# EAGLE schematic board1 (EAGLE 5.12)
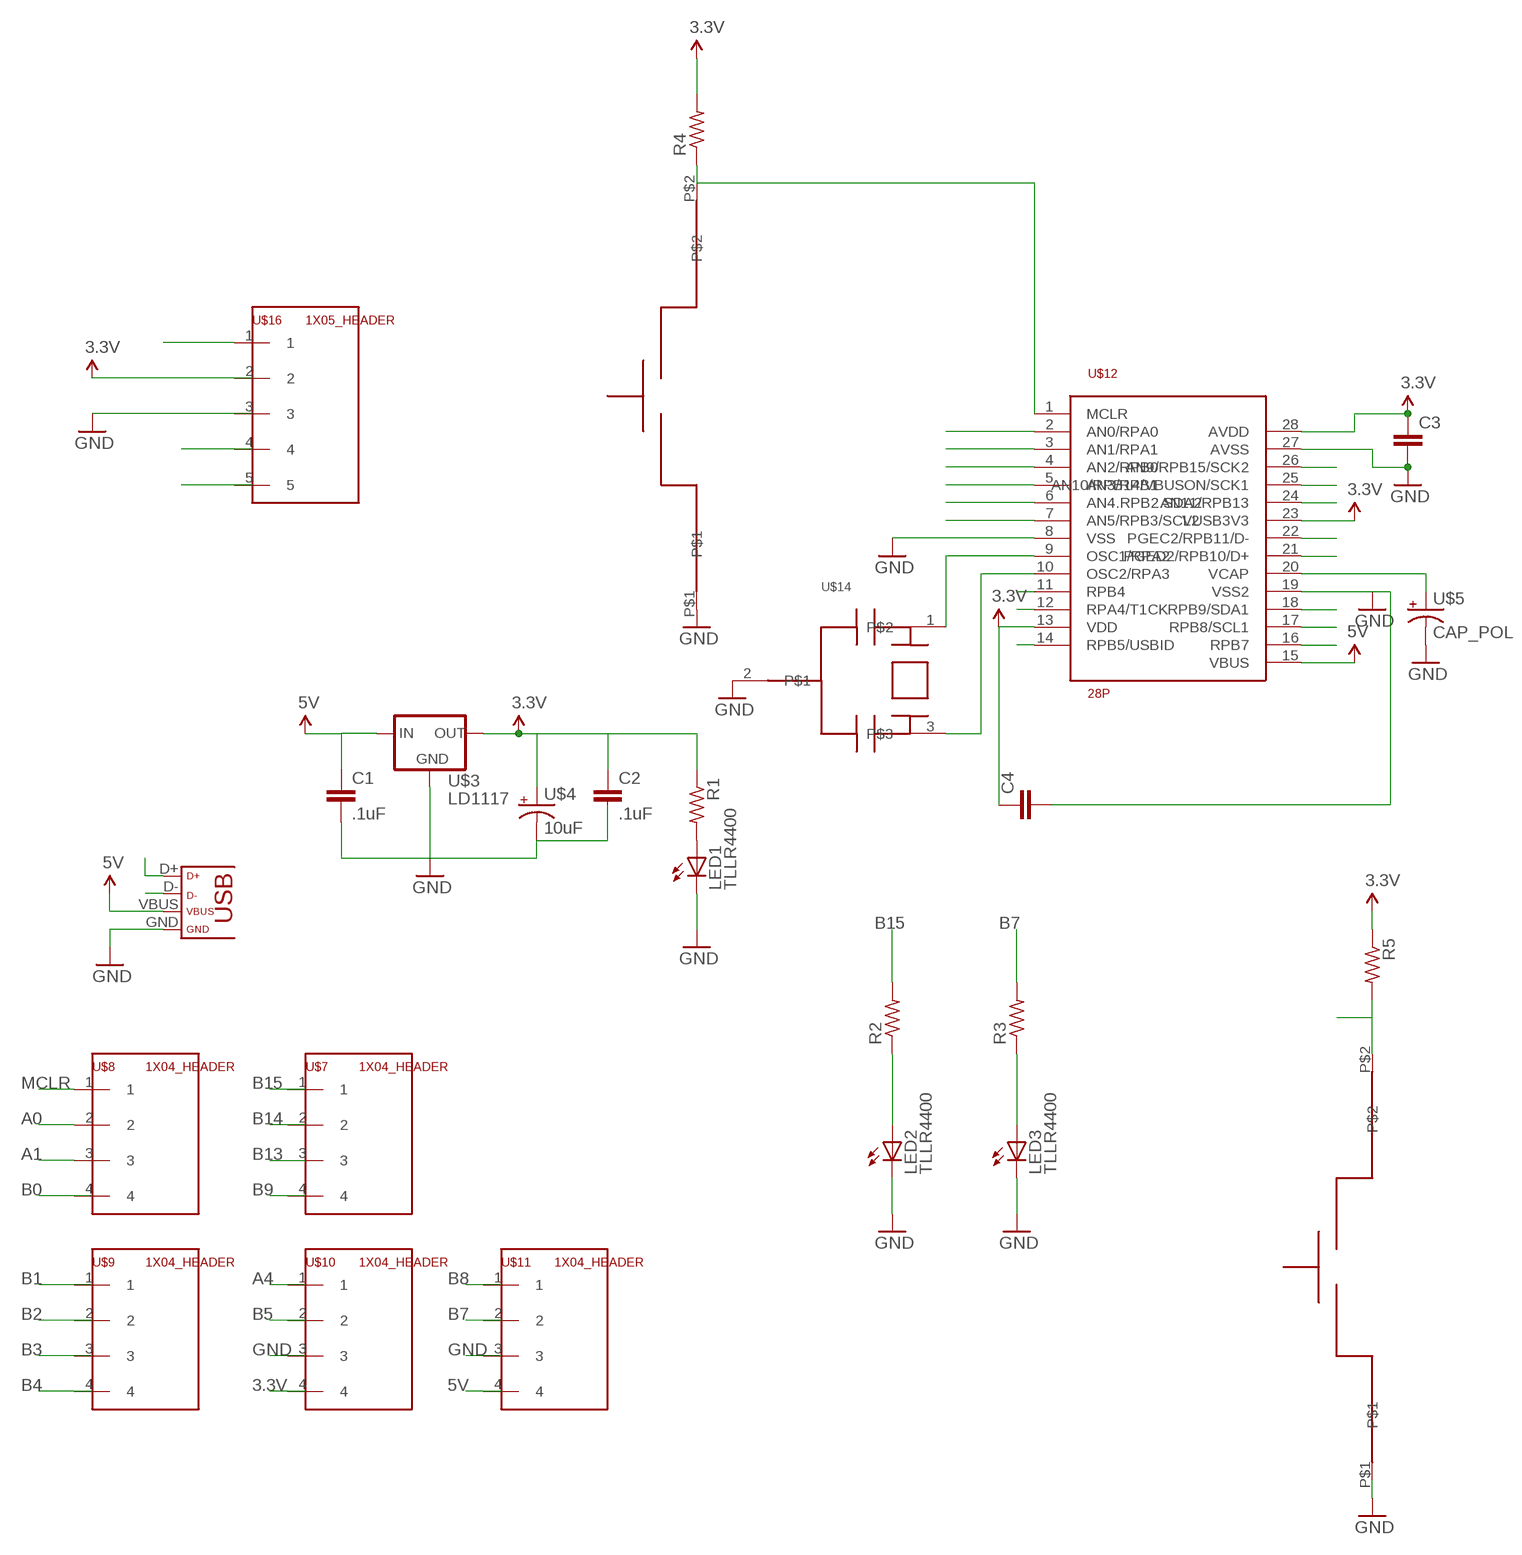
[diagram p0: schematic, sheet 1]

## Parts
C1  .1uF  C2.5/2  [C2.5-2]
C2  .1uF  C2.5/2  [C2.5-2]
C3  C2.5/2  [C2.5-2]
C4  C2.5/2  [C2.5-2]
LED1  TLLR4400  [LED3MM]
LED2  TLLR4400  [LED3MM]
LED3  TLLR4400  [LED3MM]
R1  R-US_M3216  [M3216]
R2  R-US_M3216  [M3216]
R3  R-US_M3216  [M3216]
R4  R-US_M3216  [M3216]
R5  R-US_M3216  [M3216]
U$1  USB  [USB-MINIB]
U$3  LD1117  [TO220]
U$4  10uF  CAP_POL  [CAP_POL_D]
U$5  CAP_POL  [CAP_POL_D]
U$7  1X04_HEADER  [1X04]
U$8  1X04_HEADER  [1X04]
U$9  1X04_HEADER  [1X04]
U$10  1X04_HEADER  [1X04]
U$11  1X04_HEADER  [1X04]
U$12  28P  [DIL28-3]
U$13  SWITCH  [SWITCH]
U$14  8MHZ_RESONATOR  [HC49U]
U$16  1X05_HEADER  [1X05]
U$17  SWITCH  [SWITCH]

## Nets
3.3V: C2.1 C3.1 C4.1 R1.1 R4.2 R5.1 U$3.2(OUT) U$4.1(+) U$12.13(VDD) U$12.23(VUSB3V3) U$12.28(AVDD)
5V: C1.1 U$1.VBUS U$3.3(IN) U$12.15(VBUS)
A0: U$8.2 U$12.2(AN0/RPA0)
A1: U$8.3 U$12.3(AN1/RPA1)
A4: U$12.12(RPA4/T1CK)
B0: U$12.4(AN2/RPB0)
B1: U$12.5(AN3/RPB1)
B2: U$12.6(AN4.RPB2.SDA2)
B3: U$12.7(AN5/RPB3/SCL2)
B4: U$12.11(RPB4)
B5: U$12.14(RPB5/USBID)
B7: R3.2 U$12.16(RPB7)
B8: U$12.17(RPB8/SCL1)
B9: U$12.18(RPB9/SDA1)
B13: R5.2 U$12.24(AN11/RPB13) U$17.P$2
B14: U$12.25(AN10/RPB14/VBUSON/SCK1)
B15: R2.2 U$12.26(AN9/RPB15/SCK2)
D+: U$1.D+ U$12.21(PGED2/RPB10/D+)
D-: U$1.D- U$12.22(PGEC2/RPB11/D-)
GND: C1.2 C3.2 C4.2 LED1.K(C) LED2.K(C) LED3.K(C) U$1.GND U$3.1(GND) U$4.2(-) U$5.2(-) U$12.8(VSS) U$12.19(VSS2) U$12.27(AVSS) U$13.P$1 U$14.2 U$17.P$1
MCLR: R4.1 U$8.1 U$12.1(MCLR) U$13.P$2 U$16.1
N$3: U$12.9(OSC1/RPA2) U$14.1
N$12: U$12.10(OSC2/RPA3) U$14.3
N$23: LED1.A R1.2
N$24: LED2.A R2.1
N$25: LED3.A R3.1
N$26: U$5.1(+) U$12.20(VCAP)
Unconnected: C2.2 U$7.1 U$7.2 U$7.3 U$7.4 U$8.4 U$9.1 U$9.2 U$9.3 U$9.4 U$10.1 U$10.2 U$10.3 U$10.4 U$11.1 U$11.2 U$11.3 U$11.4 U$16.2 U$16.3 U$16.4 U$16.5

## Library data of the parts
C1-C4 = capacitor-wima:C: CAPACITOR naming: grid - package width
LED1-LED3 = myboard:TLLR4400: Low Current (2mA) LED 3 mm Tinted Diffused Package color RED Source: Data sheet <http://www.farnell.com/datasheets/391100.pdf>; MF: VISHAY SEMICONDUCTOR; OC_FARNELL: 1612437
R1-R5 = resistor:R-US_: RESISTOR, American symbol
U$1 = myboard:USB
U$3 = ME433:LD1117
U$4 U$5 = ME433:CAP_POL
U$7-U$11 = ME433:1X04_HEADER
U$12 = myboard:28P
U$13 U$17 = myboard:SWITCH
U$14 = myboard:8MHZ_RESONATOR
U$16 = ME433:1X05_HEADER